# EAGLE design powerholder (EAGLE 8.6.1)
COMPANY: ADAFRUIT INDUSTRIES; DRAWN: KTOWN; REV: A

## Sheet 1 of 2
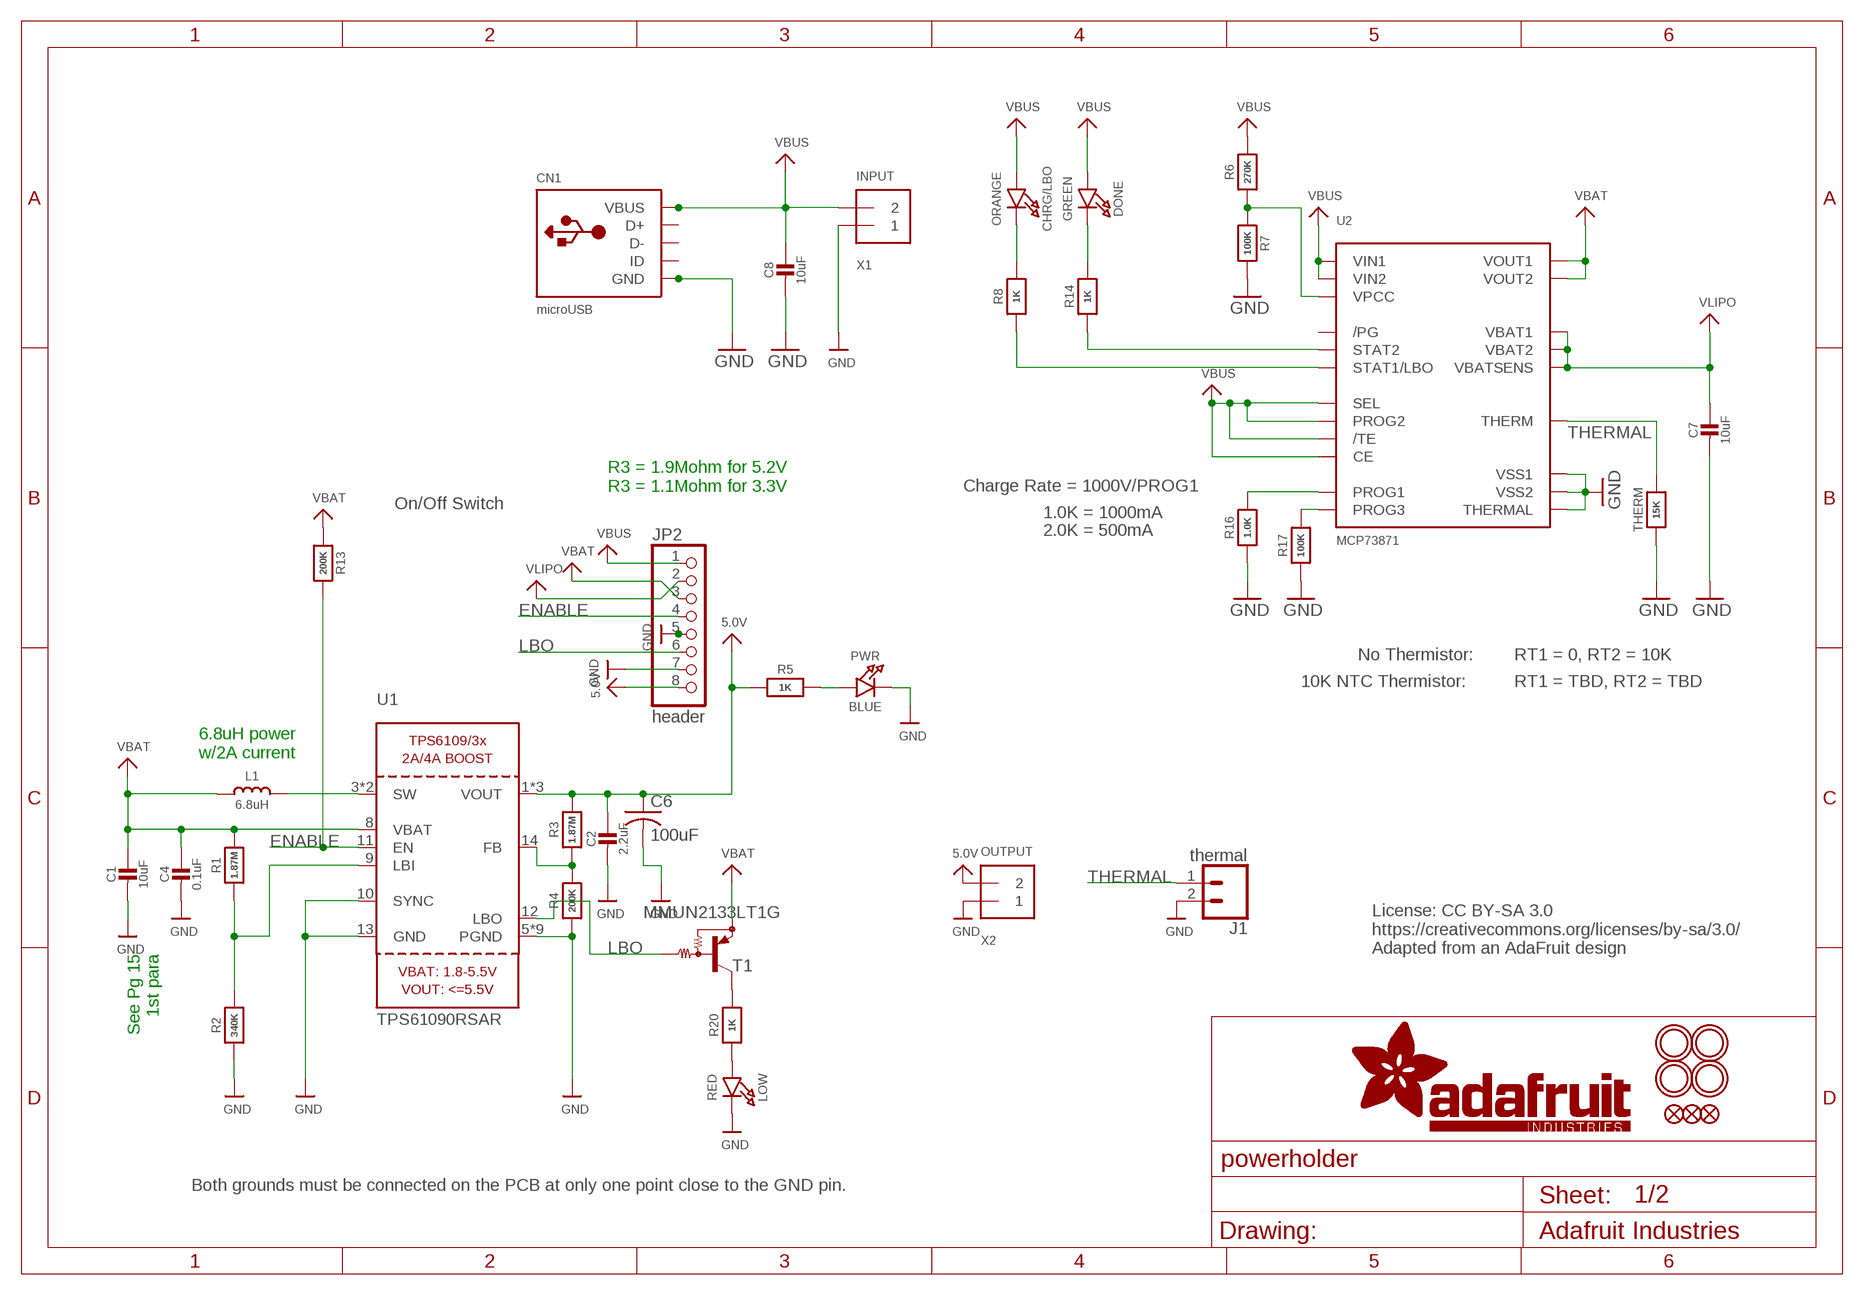
[diagram p0: schematic, sheet 1]

### Parts
C1  10uF  CAP_CERAMIC0805-NOOUTLINE  [0805-NO@1]
C2  2.2uF  CAP_CERAMIC0805-NOOUTLINE  [0805-NO@1]
C4  0.1uF  CAP_CERAMIC0805_10MGAP  [0805_10MGAP]
C6  100uF  C-USC1210  [C1210]
C7  10uF  CAP_CERAMIC0805-NOOUTLINE  [0805-NO@1]
C8  10uF  CAP_CERAMIC0805-NOOUTLINE  [0805-NO@1]
CHRG/LBO  ORANGE  LED0805_NOOUTLINE  [CHIPLED_0805_NOOUTLINE]
CN1  microUSB  USBMICRO_20329  [4UCONN_20329]
DONE  GREEN  LED0805_NOOUTLINE  [CHIPLED_0805_NOOUTLINE]
FID1  FIDUCIAL""  [FIDUCIAL_1MM]
FID2  FIDUCIAL""  [FIDUCIAL_1MM]
FID3  FIDUCIAL""  [FIDUCIAL_1MM]
J1  thermal  CONN_021X02_NO_SILK  [1X02_NO_SILK]
JP2  header  HEADER-1X8ROUND  [1X08_ROUND]
L1  6.8uH  INDUCTORTDK_VLC5045  [INDUCTOR_5X5MM_TDK_VLC5045]
LOW  RED  LED0805_NOOUTLINE  [CHIPLED_0805_NOOUTLINE]
PWR  BLUE  LED0805_NOOUTLINE  [CHIPLED_0805_NOOUTLINE]
R1  1.87M  RESISTOR_0805MP  [_0805MP]
R2  340K  RESISTOR_0805MP  [_0805MP]
R3  1.87M  RESISTOR0805_NOOUTLINE  [0805-NO]
R4  200K  RESISTOR0805_NOOUTLINE  [0805-NO]
R5  1K  RESISTOR0805_NOOUTLINE  [0805-NO]
R6  270K  RESISTOR0805_NOOUTLINE  [0805-NO]
R7  100K  RESISTOR0805_NOOUTLINE  [0805-NO]
R8  1K  RESISTOR0805_NOOUTLINE  [0805-NO]
R13  200K  RESISTOR0805_NOOUTLINE  [0805-NO]
R14  1K  RESISTOR0805_NOOUTLINE  [0805-NO]
R16  1.0K  RESISTOR0805_NOOUTLINE  [0805-NO]
R17  100K  RESISTOR0805_NOOUTLINE  [0805-NO]
R20  1K  RESISTOR0805_NOOUTLINE  [0805-NO]
T1  MMUN2133LT1G  MUN2114T1-PNP_DRIVER-SC59-BEC  [SC59-BEC]
THERM  15K  RESISTOR0805_NOOUTLINE  [0805-NO]
U1  TPS61090RSAR  VREG_TPS6103X  [PVQFN-16]
U2  MCP73871  [QFN20_4MM]
U$10  MOUNTINGHOLE2.5  [MOUNTINGHOLE_2.5_PLATED]
U$11  MOUNTINGHOLE2.5  [MOUNTINGHOLE_2.5_PLATED]
U$50  MOUNTINGHOLE2.5  [MOUNTINGHOLE_2.5_PLATED]
U$51  MOUNTINGHOLE2.5  [MOUNTINGHOLE_2.5_PLATED]
X1  INPUT  TERMBLOCK_1X2  [TERMBLOCK_1X2-3.5MM]
X2  OUTPUT  TERMBLOCK_1X2  [TERMBLOCK_1X2-3.5MM]

### Nets
5.0V: C2.1 C6.1 JP2.8 R3.2 R5.1 U1.1(VOUT) U1.15(VOUT) U1.16(VOUT) X2.2 ; also sheet 2
ENABLE: JP2.4 R13.2 U1.11(EN) ; also sheet 2
GND: C1.2 C2.2 C4.2 C6.2 C7.2 C8.2 CN1.BASE@1(GND) CN1.BASE@2(GND) CN1.GND CN1.SPRT@1(GND) CN1.SPRT@2(GND) CN1.SPRT@3(GND) CN1.SPRT@4(GND) J1.2 JP2.5 JP2.7 LOW.C PWR.C R2.1 R4.1 R7.2 R16.1 R17.1 THERM.1 U1.5(PGND) U1.6(PGND) U1.7(PGND) U1.10(SYNC) U1.13(GND) U1.P$18(PGND) U1.P$19(PGND) U1.P$20(PGND) U1.P$21(PGND) U1.P$22(PGND) U1.THERMAL(PGND) U2.P$10(VSS1) U2.P$11(VSS2) U2.P$21(THERMAL) X1.1 X2.1 ; also sheet 2
LBO: JP2.6 T1.B U1.12(LBO) ; also sheet 2
N$1: L1.P$2 U1.3(SW) U1.4(SW)
N$2: LOW.A R20.1
N$3: R1.1 R2.2 U1.9(LBI)
N$4: PWR.A R5.2
N$5: R3.1 R4.2 U1.14(FB)
N$6: R20.2 T1.C
N$7: R6.1 R7.1 U2.P$2(VPCC)
N$8: DONE.C R14.2
N$9: R14.1 U2.P$7(STAT2)
N$11: R8.1 U2.P$8(STAT1/LBO)
N$12: CHRG/LBO.C R8.2
N$13: R17.2 U2.P$12(PROG3)
N$16: R16.2 U2.P$13(PROG1)
THERMAL: J1.1 THERM.2 U2.P$5(THERM)
VBAT: C1.1 C4.1 JP2.3 L1.P$1 R1.2 R13.1 T1.E U1.8(VBAT) U2.P$1(VOUT1) U2.P$20(VOUT2) ; also sheet 2
VBUS: C8.1 CHRG/LBO.A CN1.VBUS DONE.A JP2.1 R6.2 U2.P$3(SEL) U2.P$4(PROG2) U2.P$9(/TE) U2.P$17(CE) U2.P$18(VIN1) U2.P$19(VIN2) X1.2
VLIPO: C7.1 JP2.2 U2.P$14(VBAT1) U2.P$15(VBAT2) U2.P$16(VBATSENS) ; also sheet 2
Unconnected: CN1.D+ CN1.D- CN1.ID U2.P$6(/PG)

### Notes on the sheet
- R3 = 1.9Mohm for 5.2V
  R3 = 1.1Mohm for 3.3V
- Charge Rate = 1000V/PROG1
- On/Off Switch
- 1.0K = 1000mA
- 2.0K = 500mA
- No Thermistor: | RT1 = 0, RT2 = 10K
- 10K NTC Thermistor: | RT1 = TBD, RT2 = TBD
- 6.8uH power
  w/2A current
- See Pg 15
  1st para
- License: CC BY-SA 3.0
  https://creativecommons.org/licenses/by-sa/3.0/
  Adapted from an AdaFruit design
- Both grounds must be connected on the PCB at only one point close to the GND pin.

## Sheet 2 of 2
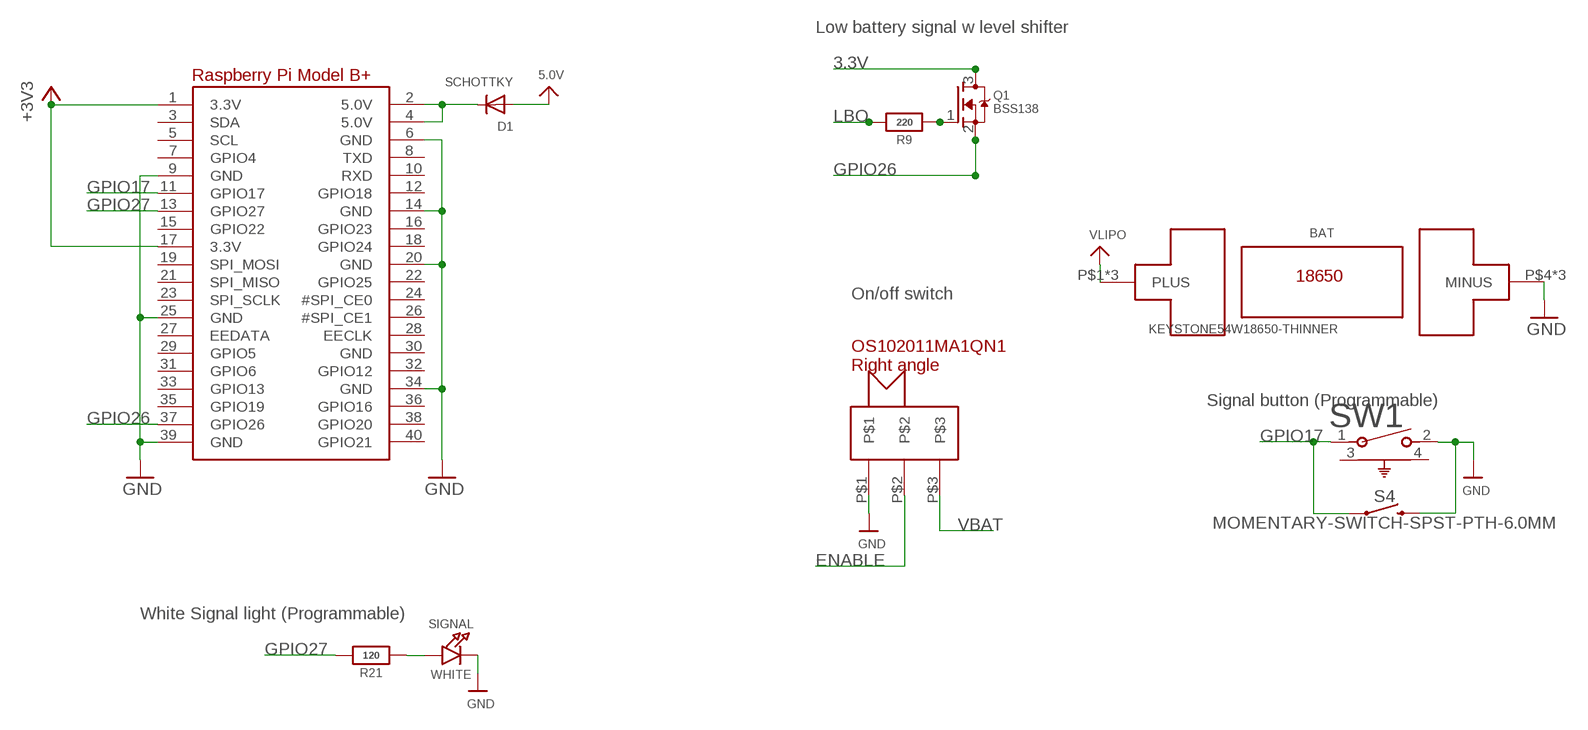
[diagram p1: schematic, sheet 2]

### Parts
BAT  KEYSTONE54W18650-THINNER  [KEYSTONE54W18650-THINNER]
D1  SCHOTTKY  DIODE_SOD-123FL  [SOD-123FL]
Q1  BSS138  MOSFET-NREFLOW  [SOT23-R]
R9  220  RESISTOR0805_NOOUTLINE  [0805-NO]
R21  120  RESISTOR0805_NOOUTLINE  [0805-NO]
RPI1  RASPBERRYPI_BPLUS_BONNETNODIM  [PI_BONNET_NODIM]
S4  MOMENTARY-SWITCH-SPST-PTH-6.0MM  [TACTILE_SWITCH_PTH_6.0MM]
SIGNAL  WHITE  LED0805_NOOUTLINE  [CHIPLED_0805_NOOUTLINE]
SW1  1825027-5  [SW2_1825027-A]
SW2  OS102011MA1QN1  [OS102011MA1QN1]

### Nets
3.3V: Q1.3(D) RPI1.1(3.3V) RPI1.17(3.3V) ; supply symbol labelled +3V3
5.0V: D1.A ; also sheet 1
5.0V@1: D1.C RPI1.2(5.0V) RPI1.4(5.0V)
ENABLE: SW2.P$2 ; also sheet 1
GND: BAT.P$4(MINUS) BAT.P$5(MINUS) BAT.P$6(MINUS) RPI1.6(GND) RPI1.9(GND) RPI1.14(GND) RPI1.20(GND) RPI1.25(GND) RPI1.34(GND) RPI1.39(GND) S4.3 SIGNAL.C SW1.2 SW2.P$1 ; also sheet 1
GPIO17: RPI1.11(GPIO17) S4.1 SW1.1
GPIO26: Q1.2(S) RPI1.37(GPIO26)
GPIO27: R21.2 RPI1.13(GPIO27)
LBO: R9.2 ; also sheet 1
N$14: Q1.1(G) R9.1
N$15: R21.1 SIGNAL.A
VBAT: SW2.P$3 ; also sheet 1
VLIPO: BAT.P$1(PLUS) BAT.P$2(PLUS) BAT.P$3(PLUS) ; also sheet 1
Unconnected: RPI1.3(SDA) RPI1.5(SCL) RPI1.7(GPIO4) RPI1.8(TXD) RPI1.10(RXD) RPI1.12(GPIO18) RPI1.15(GPIO22) RPI1.16(GPIO23) RPI1.18(GPIO24) RPI1.19(SPI_MOSI) RPI1.21(SPI_MISO) RPI1.22(GPIO25) RPI1.23(SPI_SCLK) RPI1.24(#SPI_CE0) RPI1.26(#SPI_CE1) RPI1.27(EEDATA) RPI1.28(EECLK) RPI1.29(GPIO5) RPI1.31(GPIO6) RPI1.32(GPIO12) RPI1.33(GPIO13) RPI1.35(GPIO19) RPI1.36(GPIO16) RPI1.38(GPIO20) RPI1.40(GPIO21) SW1.3 SW1.4

### Notes on the sheet
- Low battery signal w level shifter
- On/off switch
- Signal button (Programmable)
- White Signal light (Programmable)

## Power pins joined to a net without a drawn wire
GND: RPI1.30(GND)

## Library data of the parts
BAT = imp-keystone-battery-clip-54:KEYSTONE54W18650-THINNER
C1 C2 C4 C7 C8 = microbuilder:CAP_CERAMIC: Ceramic Capacitors For new designs, use the packages preceded by an '_' character since they are more reliable: The following footprints should be used on most boards: _0402 - Standard footprint for regular board layouts _0603 - Standard footprint for regular board layouts _0805 - Standard footprint for regular board layouts _1206 - Standard footprint for regular board layouts For extremely tight-pitch boards where space is at a premium, the following 'micro-pitch' footprints can be used (smaller pads, no silkscreen outline, etc.): _0402MP - Micro-pitch footprint for very dense/compact boards _0603MP - Micro-pitch footprint for very dense/compact boards _0805MP - Micro-pitch footprint for very dense/compact boards _1206MP - Micro-pitch footprint for very dense/compact boards
C6 = rcl:C-US: CAPACITOR, American symbol
CHRG/LBO DONE LOW PWR SIGNAL = microbuilder:LED: LED 0603 - 0603 Surface Mount Package 2mA: Green LED - Low Power (3.9mcd, 2ma, 1.7Vf) - Digikey: 475-2709-2-ND Orange LED - Low Power (9.8mcd, 2ma, 1.8Vf) - Digikey: 475-1194-2-ND Red LED - Low Power (5mcd, 2ma, 1.8Vf) - Digikey: 475-1195-2-ND Yellow LED - Low Power (7mcd, 2ma, 1.8Vf) - Digikey: 475-1196-2-ND 5mA: Blue LED - Low Power (17mcd, 5ma, 2.9Vf) - Digikey: LNJ937W8CRACT-ND 0805 - 0805 Surface Mount Package 2mA: Red LED (8.8mcd, 2mA, 1.8Vf, Clear) - Low Power [Digikey: 475-2510-1-ND] Green LED (5mcd, 2mA, 1.8Vf, Clear) - Low Power [Digikey: 475-2730-1-ND] Yellow LED (11.3mcd, 2mA, 1.8Vf, Clear) - Low Power [Digikey: 475-2555-1-ND] 20mA: Red LED (104mcd, 20mA, Diffused) - LS R976 [Digikey: 475-1278-6-ND] Red LED (12mcd, 20mA, 2.0Vf, Clear) - APT2012EC [Digikey: 754-1128-1-ND] Green LED (15mcd, 20mA, 2.2Vf, Clear) - APT2012GC [Digikey: 754-1131-1-ND] Orange LED (160mcd, 20mA, 2.1Vf, Clear) - APT2012SECK [Digikey: 754-1130-1-ND] 1206 - 1206 Surface Mount Package Green LED (26mcd, 20mA, Diffused) - LG N971 [Digikey: 475-1407-6-ND] Red LED (15mcd, 20mA, Diffused) - LH N974 [Digikey: 475-1416-6-ND] Cree - Cree High-Power Surface Mount LEDs XPEBWT-L1-0000-00D50 - White 111lm 350mA 2.9Vf 6200K 110° XTEAWT-00-0000-00000LEE3 - White 114lm 350mA 2.85Vf 5000K 115° Everlight - Everlight 45-21 Series Surface Mount LEDs 45-21/QK2C-B2832AC2CB2/2T - Warm White 2000mcd 20mA 3.25Vf 3050K 120° 45-21/LK2C-B38452C4CB2/2T - Nuetral White 2000mcd 20mA 3.25Vf 4150K 120° 45-21/LK2C-B50634C6CB2/2T - Cold White 2200mcd 20mA 3.25Vf 5650K 120° PLCC2 Reverse Mount LS T77K-J1L2-1-0-2-R18-Z - Red 11.25mcd 2mA 1.8Vf 630nm 120° LO T77K-L1M2-24-Z - Orange 19.6mcd 2mA 1.8Vf 606nm 120° LY T77K-K2M1-26-Z - Yellow 15.7mcd 2mA 1.8Vf 587nm 120°
CN1 = microusb-amphenol-10118194-0001LF:USB: USB Connectors USBMINIB - Surface Mount Female Mini-B USB Connector 4UConnector: 06564
D1 = adafruit:DIODE: Diode SMADIODE - SMA Surface Mount Package 20V 1A Schottky Diode Digikey: 641-1014-6-ND DO-1N4148 - Through Hole Small Current Diode SOD-123 20V 1 A (.5mV Vf) Schottky Diode - Digikey: MBRX120TPMSCT-ND SOD-323 10V 570mA (.38mV Vf, 3ns) Schottky Diode - Digikey: ZLLS410CT-ND SOD-523 30V 30mA Schottky Diode (RB751S-40TE61) - Digikey: RB751S-40TE61CT-ND SOT23-R/W - SOT23 Package (R = Solder Paste/Reflow Ovens, W = Hand-Soldering) BAT54Film 40V 300mA - Digikey: 497-7162-1-ND
FID1-FID3 = microbuilder:FIDUCIAL: Fiducial Alignment Points Various fiducial points for machine vision alignment.; BOM: EXCLUDE
J1 = SparkFun-Connectors:CONN_02: Multi connection point. Often used as Generic Header-pin footprint for 0.1 inch spaced/style header connections On any of the 0.1 inch spaced packages, you can populate with these: Break Away Headers - Straight <https://www.sparkfun.com/products/116> (PRT-00116) Break Away Male Headers - Right Angle <https://www.sparkfun.com/products/553> (PRT-00553) Female Headers <https://www.sparkfun.com/products/115> (PRT-00115) Break Away Headers - Machine Pin <https://www.sparkfun.com/products/117> (PRT-00117) Break Away Female Headers - Swiss Machine Pin <https://www.sparkfun.com/products/743> (PRT-00743) For SCREWTERMINALS and SPRING TERMINALS visit here: Screw Terimnals on SparkFun.com <https://www.sparkfun.com/search/results?term=Screw+Terminals> (5mm/3.5mm/2.54mm spacing) This device is also useful as a general connection point to wire up your design to another part of your project. Our various solder wires solder well into these plated through hole pads. Hook-Up Wire - Assortment (Stranded, 22 AWG) <https://www.sparkfun.com/products/11375> (PRT-11375) Hook-Up Wire - Assortment (Solid Core, 22 AWG) <https://www.sparkfun.com/products/11367> (PRT-11367) View the entire wire category on our website here <https://www.sparkfun.com/categories/141> Special notes: Molex polarized connector foot print use with: PRT-08233 with associated crimp pins and housings. 2.54_SCREWTERM for use with PRT-10571. 3.5mm Screw Terminal footprints for PRT-08084 5mm Screw Terminal footprints for use with PRT-08432
JP2 = microbuilder:HEADER-1X8: PIN HEADER
L1 = microbuilder:INDUCTOR: Inductors 0603: 10nH Ceramic Inductor - microwire antenna/RF (Digikey: 712-1434-2-ND) 0805: 560nH Ceramic Inductor - RF (Digikey: 553-1047-1-ND) 270nH Ceramic Inductor - Q = 40@250MHz, +-5%, 1 Ohm DC Resistance (Digikey: 535-10506-2-ND) 1007 (2518 Metric) SMT: 10µH 10% 250mOhm 820mA 1007 Inductor (Digikey: 587-2189-1-ND) 22µH 10% 500mOhm 580mA 1007 Inductor (Digikey: 587-2190-1-ND) 47µH 10% 950mOhm 420mA 1007 Inductor (Digikey: 587-2191-1-ND) 47µH 5% 100mOhm 1A 1008 Inductor (Digikey: 732-1816-1-ND) 5.0x5.0mm (Taiyo Yuden NR5040 Series) 6.8µH 20% 2.3A 64mOhm Inductor (Digikey: 587-2374-2-ND) 5.0x5.0mm (TDK VLC5045 Series) 4.7µH 20% 3.3A 34mOhm Inductor (Digikey: 445-6526-1-ND) 6.8µH 20% 2.7A 46mOhm Inductor (Digikey: 445-6527-1-ND) 6.0x6.0mm (TDK VLC6045 Series) 4.7µH 20% 3.8A 27mOhm Inductor (Digikey: 445-6538-2-ND) 6.8µH 20% 3A 41mOhm Inductor (Digikey: 445-6540-1-ND) 6.2µH 30% 2.2A 45mOhm Inductor (Digikey: SRR5028-6R2YCT-ND) - Not TDK VLC6045 but footprint should match 6.0x6.0mm (TDK SLF6045 Series) 6.8uH 30% 2A 33mOhm Inductor (Digikey: 445-4572-1-ND, Mouser: 810-SLF645T6R8N2R0PF) 6.0x6.0mm (Sumida CDRH5D28 Series) 6.2uH 30% 1.8A 45mOhm Inductor (Digikey: 308-1542-1-ND) Taiyo Yuden NR3015T2R2M - 2.2uH 20% 1.5A (Digikey: 587-1648-2-ND, Mouser: 963-NR3015T2R2M) - Used with TI TPS62172 CoilCraft RFID Transponder Coil - MA5532-AE (For use with AS3935 Lightning Sensor) Vishay IHLP 1.0uH Molded Inductor - 24mOhm DCR, 5A, +/-20%, -55°C-125°C (Digikey: 541-1319-1-ND)
Q1 = microbuilder:MOSFET-N: N-Channel Mosfet LEGEND VDS: Voltage Drain-Source ID: Drain Current RDS(ON): Drain-Source On-State Resistance VGS(TH): Gate-Source Threshold Voltage CISS: Drain-Source Input Capacitance SOT-23 Name VDS ID RDS(ON) VGS(TH) CISS Order Number 2N7002E 60V 260mA 2.5 Ohm 2.5V @ 250uA 26.7pF @ 25V 2N7002ET1GOSTR-ND BSH103 30V 850mA 400 mOhm 400mV @ 1mA 83pF @ 24V BSH103,235-ND BSS138 60V 320mA 1.6 Ohm 1.5V @ 250uA 50pF @ 10V Mouser: 771-BSS138PW115 DMN2075U-7 20V 4.2A 38 mOhm 1V @ 250 uA 594.3pF @ 10V DMN2075U-7DICT-ND * BSS138 good choice for I2C level-shifting
R1-R9 R13 R14 R16 R17 R20 R21 THERM = microbuilder:RESISTOR: Resistors For new designs, use the packages preceded by an '_' character since they are more reliable: The following footprints should be used on most boards: _0402 - Standard footprint for regular board layouts _0603 - Standard footprint for regular board layouts _0805 - Standard footprint for regular board layouts _1206 - Standard footprint for regular board layouts For extremely tight-pitch boards where space is at a premium, the following 'micro-pitch' footprints can be used (smaller pads, no silkscreen outline, etc.): _0402MP - Micro-pitch footprint for very dense/compact boards _0603MP - Micro-pitch footprint for very dense/compact boards _0805MP - Micro-pitch footprint for very dense/compact boards _1206MP - Micro-pitch footprint for very dense/compact boards
RPI1 = microbuilder:RASPBERRYPI_BPLUS
S4 = SparkFun-Switches:MOMENTARY-SWITCH-SPST: Momentary Switch (Pushbutton) - SPST Normally-open (NO) SPST momentary switches (buttons, pushbuttons). Variants PTH-12MM - 12mm square, through-hole Momentary Pushbutton Switch - 12mm Square <https://www.sparkfun.com/products/9190> (COM-09190) PTH-6.0MM, PTH-6.0MM-KIT - 6.0mm square, through-hole Mini Pushbutton Switch <https://www.sparkfun.com/products/97> (COM-00097) KIT package intended for soldering kit's - only one side of pads' copper is exposed. PTH-RIGHT-ANGLE-KIT - Right-angle, through-hole Right Angle Tactile Button <https://www.sparkfun.com/products/10791> - Used on SparkFun BigTime Watch Kit <https://www.sparkfun.com/products/11734> SMD-12MM - 12mm square, surface-mount Tactile Button - SMD (12mm) <https://www.sparkfun.com/products/12993> (COM-12993) Used on SparkFun PicoBoard <https://www.sparkfun.com/products/11888> SMD-4.5MM - 4.5mm Square Trackball Switch Used on SparkFun Blackberry Trackballer Breakout <https://www.sparkfun.com/products/13169> SMD-4.6MMX2.8MM - 4.60mm x 2.80mm, surface mount Used on SparkFun SAMD21 Mini Breakout <https://www.sparkfun.com/products/13664> SMD-5.2MM, SMD-5.2-REDUNDANT - 5.2mm square, surface-mount Mini Pushbutton Switch - SMD <https://www.sparkfun.com/products/8720> (COM-08720) Used on Arduino Pro Mini <https://www.sparkfun.com/products/11114> REDUNDANT package connects both switch circuits together SMD-6.0X3.5MM - 6.0 x 3.5mm, surface mount Momentary Reset Switch SMD <https://www.sparkfun.com/products/8229> (COM-08229) SMD-6.2MM-TALL - 6.2mm square, surface mount Tactile Button - SMD (6mm) <https://www.sparkfun.com/products/12992> Used on SparkFun Digital Sandbox <https://www.sparkfun.com/products/12651> SMD-RIGHT-ANGLE - Right-angle, surface mount Used on SparkFun Block for Intel® Edison - Arduino <https://www.sparkfun.com/products/13036>; PROD_ID: SWCH-08441; SF_SKU: COM-00097
SW1 = right angle tactile switch 1825027-5 te connect:1825027-5: Digi-Key part <https://www.digikey.com/product-detail/en/te-connectivity-alcoswitch-switches/1825027-5/450-1662-ND/529484>; MANUFACTURER_PART_NUMBER: 18250275; VENDOR: TE Connectivity
SW2 = rightangleslideswitchspdt:OS102011MA1QN1: OS102011MA1QN1 right angle SPDT slide switch from C&K Vendor Specs <https://www.ckswitches.com/media/1428/os.pdf> Digikey part <https://www.digikey.com/product-detail/en/c-k/OS102011MA1QN1/CKN9559-ND/1981430>
T1 = transistor:*-PNP_DRIVER-: PNP Bias Resistor Transistor
U1 = microbuilder:VREG_TPS6103X: TPS6103x 4A Boost - 1.8-5.5V Input, Adjustable Output to 5.5V
U2 = microbuilder:MCP73871: MCP73871 Lithium Polymer Battery Charger Digikey: MCP73871-2CCI/ML-ND
U$10 U$11 U$50 U$51 = microbuilder:MOUNTINGHOLE: Mounting Hole For #2 screws (0.086"/2.18mm width, 0.094"/2.4mm hole) use 2.5mm; BOM: EXCLUDE
X1 X2 = microbuilder:TERMBLOCK_1X2: 3.5mm Terminal block http://www.ladyada.net/library/pcb/eaglelibrary.html

## Board
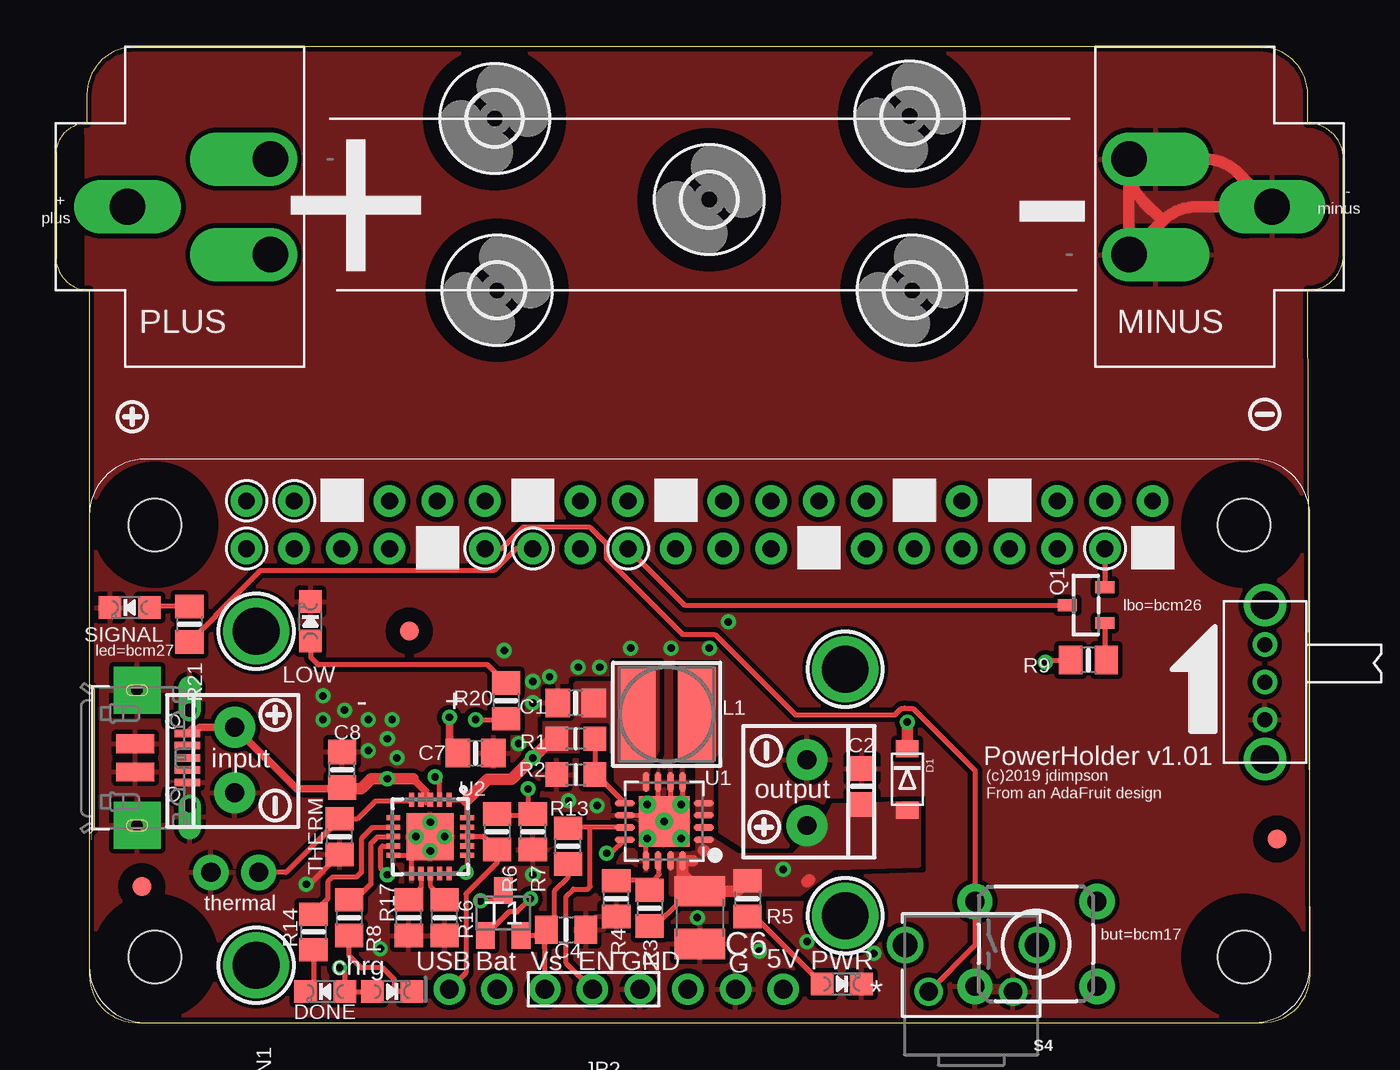
[diagram p2: board, top side]
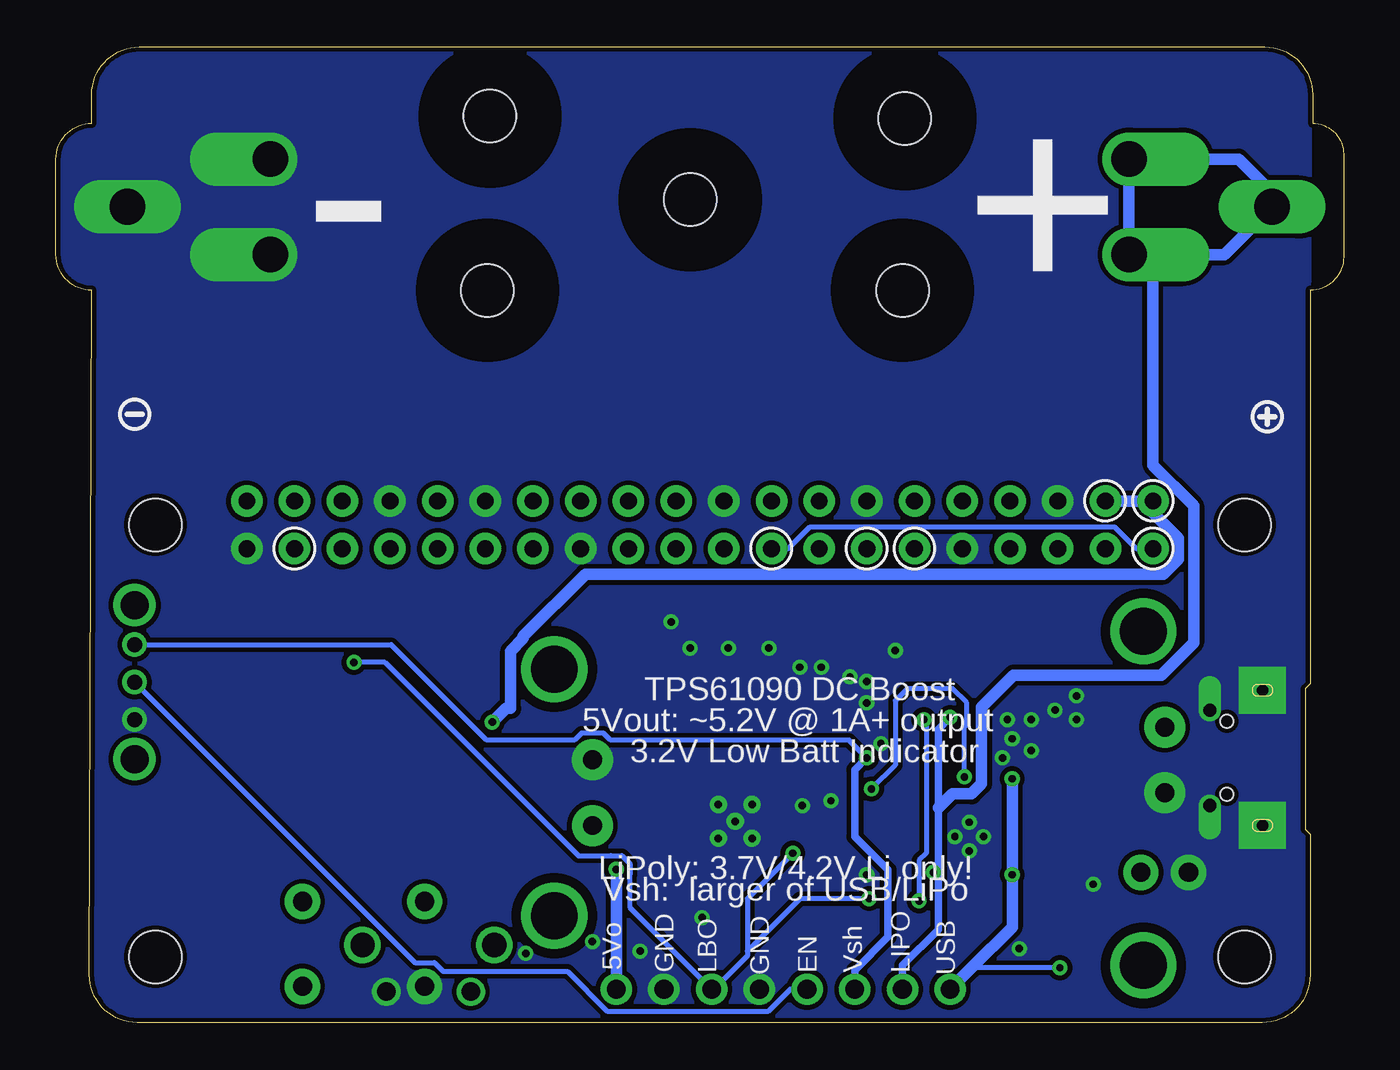
[diagram p3: board, bottom side, seen from below]

Size 68.58 x 51.94 mm. Coordinates in mm from the lower left corner, seen from the top.
Outline: 1.78,10.03 1.78,2.54 arc90 4.32,0 64.25,0 arc90 66.79,2.55 66.68,38.99 arc90 68.58,40.89 68.58,45.97 arc90 66.68,47.88 66.68,49.4 arc90 64.14,51.94 4.19,51.94 arc90 1.65,49.4 1.65,47.88 arc90 0,46.23 0,40.77 arc90 1.78,38.99 1.78,18.03 2.03,17.78 2.03,10.29 1.78,10.03
Copper layers (1*16): Top 0.035mm / dielectric 1.5mm / Bottom 0.035mm
Design rules "adafruit *": minimum track width 8mil, minimum drill 15.5mil, track to track 8mil, track to pad 8mil, pad to pad 8mil, via to via 8mil, smd to smd 8mil, copper to edge 10mil, drill to drill 8mil, minimum pad ring 10mil, minimum via ring 8mil, stop-mask expansion 2mil, vias tented up to drill 20mil, thermal gap 10mil

### Footprints (pad centres in the part's own frame; a part is rotated, then mirrored left to right if it is on the bottom)
KEYSTONE54W18650-THINNER = drill 1.905 offset: P$1 -20.955,-2.159; P$2 -20.955,2.921; P$4 24.765,2.921; P$5 24.765,-2.159 | drill 1.905 long: P$3 -28.575,0.381; P$6 32.385,0.381
0805-NO@1 = smd 1.3 x 1.5: 1 -0.95,0; 2 0.95,0
0805_10MGAP = smd 1.2 x 1.5: 1 -1.05,0; 2 1.05,0
C1210 = smd 1.6 x 2.7: 1 -1.4,0; 2 1.4,0
CHIPLED_0805_NOOUTLINE = smd 1.2 x 1.2: A 0,-1.05; C 0,1.05
4UCONN_20329 = smd 1 x 2: BASE@1 -0.75,-2; BASE@2 0.75,-2 | smd 0.4 x 1.35: D+ 0,0.775; D- -0.65,0.775; GND 1.3,0.775; ID 0.65,0.775; VBUS -1.3,0.775 | drill 0.7 offset: SPRT@1 -2.538,0.9; SPRT@2 2.538,0.9 | drill 0.6 pad 2.5 square: SPRT@3 -3.6,-1.9; SPRT@4 3.6,-1.9 | hole 0.7: -1.95,0; 1.95,0
SOD-123FL = smd 0.91 x 1.22: A 1.637,0; C -1.637,0
FIDUCIAL_1MM = smd 1 x 1: 1 0,0
1X02_NO_SILK = drill 1.016 pad 1.88: 1 0,0; 2 2.54,0
1X08_ROUND = drill 1 pad 1.676: 1 -8.89,0; 2 -6.35,0; 3 -3.81,0; 4 -1.27,0; 5 1.27,0; 6 3.81,0; 7 6.35,0; 8 8.89,0
INDUCTOR_5X5MM_TDK_VLC5045 = smd 2 x 5: P$1 -1.6,0; P$2 1.6,0
SOT23-R = smd 0.635 x 1.016: 1 -0.95,-1; 2 0.95,-1; 3 0,1
_0805MP = smd 1.2 x 1.3: 1 -1.016,0; 2 1.016,0
0805-NO = smd 1.24 x 1.5: 1 -0.95,0; 2 0.95,0
PI_BONNET_NODIM = drill 0.9 pad 1.676: 1 8.37,25.23; 2 8.37,27.77; 3 10.91,25.23; 4 10.91,27.77; 5 13.45,25.23; 6 13.45,27.77; 7 15.99,25.23; 8 15.99,27.77; 9 18.53,25.23; 10 18.53,27.77; 11 21.07,25.23; 12 21.07,27.77; 13 23.61,25.23; 14 23.61,27.77; 15 26.15,25.23; 16 26.15,27.77; 17 28.69,25.23; 18 28.69,27.77; 19 31.23,25.23; 20 31.23,27.77; 21 33.77,25.23; 22 33.77,27.77; 23 36.31,25.23; 24 36.31,27.77; 25 38.85,25.23; 26 38.85,27.77; 27 41.39,25.23; 28 41.39,27.77; 29 43.93,25.23; 30 43.93,27.77; 31 46.47,25.23; 32 46.47,27.77; 33 49.01,25.23; 34 49.01,27.77; 35 51.55,25.23; 36 51.55,27.77; 37 54.09,25.23; 38 54.09,27.77; 39 56.63,25.23; 40 56.63,27.77 | hole 2.8: 3.5,3.5; 3.5,26.5; 61.5,26.5; 61.5,3.5
TACTILE_SWITCH_PTH_6.0MM = drill 1.016 pad 1.88: 1 -3.251,2.261; 2 3.251,2.261; 3 -3.251,-2.261; 4 3.251,-2.261
SW2_1825027-A = drill 0.991 pad 1.499: 1 0,0; 2 4.496,0 | drill 1.295 pad 1.803: 3 -1.245,2.489; 4 5.766,2.489
OS102011MA1QN1 = drill 0.8: P$1 0,0; P$2 2,0; P$3 4,0 | drill 1.5: P$4 -2.1,0; P$5 6.1,0
SC59-BEC = smd 1 x 1.4: B -0.95,-1.2; C 0,1.2; E 0.95,-1.2
PVQFN-16 = smd 1.05 x 0.35: 1 -2.1,0.975; 2 -2.1,0.325; 3 -2.1,-0.325; 4 -2.1,-0.975; 9 2.1,-0.975; 10 2.1,-0.325; 11 2.1,0.325; 12 2.1,0.975 | smd 0.35 x 1.05: 5 -0.975,-2.1; 6 -0.325,-2.1; 7 0.325,-2.1; 8 0.975,-2.1; 13 0.975,2.1; 14 0.325,2.1; 15 -0.325,2.1; 16 -0.975,2.1 | drill 0.4: P$18 0,0; P$19 -0.9,0.9; P$20 0.9,0.9; P$21 0.9,-0.9; P$22 -0.9,-0.9 | smd 2.7 x 2.7: THERMAL 0,0
QFN20_4MM = smd 0.73 x 0.28: P$1 -1.965,1; P$2 -1.965,0.5; P$3 -1.965,0; P$4 -1.965,-0.5; P$5 -1.965,-1; P$11 1.965,-1; P$12 1.965,-0.5; P$13 1.965,0; P$14 1.965,0.5; P$15 1.965,1 | smd 0.28 x 0.73: P$6 -1,-1.965; P$7 -0.5,-1.965; P$8 0,-1.965; P$9 0.5,-1.965; P$10 1,-1.965; P$16 1,1.965; P$17 0.5,1.965; P$18 0,1.965; P$19 -0.5,1.965; P$20 -1,1.965 | smd 2.5 x 2.5: P$21 0,0
2,8 = hole 2.8: 0,0
MOUNTINGHOLE_2.5_PLATED = drill 2.5 pad 3.2: P$1 0,0
TERMBLOCK_1X2-3.5MM = drill 1 pad 2.184: 1 1.8,0; 2 -1.7,0

### Placement (x,y rotation side)
BAT  32.38,43.05 0 top
C1  27.69,17.02 180 top
C2  42.93,12.57 90 top
C4  27.18,4.95 0 top
C6  34.29,5.59 270 top
C7  22.35,14.35 0 top
C8  15.24,13.46 90 top
CHRG/LBO  17.91,1.65 270 top
CN1  6.22,14.1 270 top
D1  45.34,12.95 270 top
DONE  14.35,1.65 90 top
FID1  65.02,9.78 0 top
FID2  18.82,20.85 90 top
FID3  4.57,7.24 0 top
J1  10.79,8 180 top
JP2  29.84,1.78 0 top
L1  32.53,16.41 0 top
LOW  13.56,21.37 0 top
PWR  41.85,2.06 270 top
Q1  54.86,22.23 90 top
R1  27.69,15.11 180 top
R2  27.69,13.21 0 top
R3  31.62,6.1 270 top
R4  29.84,6.6 90 top
R5  36.83,6.6 270 top
R6  23.49,10.16 270 top
R7  25.4,10.16 270 top
R8  15.62,5.59 270 top
R9  54.99,19.3 180 top
R13  27.27,9.4 90 top
R14  13.72,4.83 270 top
R16  20.7,5.59 90 top
R17  18.8,5.59 90 top
R20  23.97,17.13 270 top
R21  7.11,21.21 270 top
RPI1  1.78,0 0 top
S4  52.2,4.19 0 top
SIGNAL  3.94,22.1 90 top
SW1  46.48,1.65 0 top
SW2  64.39,16.13 90 top
T1  23.83,5.84 0 top
THERM  15.11,9.91 90 top
U1  32.4,10.71 180 top
U2  19.94,9.91 270 top
U$5  [2,8]  34.8,43.81 0 top
U$10  10.67,20.83 0 top
U$11  10.67,3.05 0 top
U$12  [SYMBOL_MINUS]  64.39,32.38 180 top
U$15  [2,8]  23.37,48.13 0 top
U$16  [2,8]  23.49,38.99 0 top
U$17  [2,8]  45.59,38.99 0 top
U$18  [2,8]  45.47,48.26 0 top
U$21  [SYMBOL_PLUS]  4.06,32.26 90 top
U$22  [SYMBOL_PLUS]  11.68,16.38 90 top
U$28  [SYMBOL_MINUS]  11.68,11.56 270 top
U$45  [SYMBOL_PLUS]  37.72,10.41 90 top
U$50  42.04,18.82 0 top
U$51  42.04,5.69 0 top
U$52  [SYMBOL_PLUS]  4.06,32.26 90 bottom
U$53  [SYMBOL_MINUS]  64.39,32.38 180 bottom
U$54  [SYMBOL_MINUS]  37.85,14.48 270 top
X1  9.53,14.03 270 top
X2  40,12.19 90 top

### Tracks (layer width: path | path; a pad name or v marks a point on that pad's centre or on a via)
3.3V
  Top 0.254: RPI1.17 33.47,22.23 Q1.3
  Bottom 0.254: RPI1.17 29.58,25.23 28.41,26.4 12.2,26.4 11.04,25.23 RPI1.1
5.0V  (via drill 0.39)
  Top 0.254: R3.2 31.94,5.15 33.15,6.35 33.65,6.35 C6.1
  Top 0.61: 40,7.49 40.13,7.62 | 34.5,9.19 34.54,9.14 | 33.92,8.61 U1.16 33.37,7.9 C6.1 36.26,6.99 R5.1
  Bottom 0.61: JP2.8 v38.73,8.16
  pour Top (isolate 0.254, no thermals): 32.77,9.02 32.77,6.86 39.62,6.86 41.4,8.26 45.97,8.38 45.97,11.68 41.4,11.56 40.51,9.78 40.13,9.78 39.24,8.89 36.32,8.89 34.92,9.78 34.16,9.78 34.16,9.02
5.0V@1  (via drill 0.39)
  Top 0.61: D1.C v45.34,16
  Bottom 0.61: RPI1.4 RPI1.2 10.15,27.13 8.8,25.79 8.8,24.67 9.59,23.88 40.38,23.88 43.69,20.57 43.69,20.45 44.36,19.78 44.36,16.73 44.61,16.73 v45.34,16
ENABLE
  Top 0.254: U1.11 28.45,10.39 | 28.45,10.39 27.31,10.39 R13.2 | JP2.4 27.18,3.17 27.18,6.73 27.56,7.11 28.32,7.11 28.45,7.24 28.45,10.39
  Bottom 0.254: SW2.P$2 49.46,3.2 48.42,3.2 47.95,2.73 41.34,2.73 39.22,0.61 30.63,0.61 29.46,1.78 JP2.4
GND  (via drill 0.39)
  Top 0.254: U1.13 31.42,9.58 31.62,9.78 31.53,9.78 U1.P$20 | U1.10 31.74,11.04 31.75,11.05 31.5,11.3 U1.P$21 31.57,11.68 32,11.68 32.07,11.75 U1.7 | U1.6 32.72,11.47 32.89,11.3 | U1.5 33.37,11.69 U1.P$22 | U2.P$11 18.94,9.67 v19.18,9.91 | U2.P$10 19.7,8.91 v19.94,9.14 | THERM.1 13.52,7.37 v13.34,7.37
  Top 0.61: BAT.P$4 BAT.P$5 58.95,42.69 | BAT.P$4 61.18,45.97 arc-45 62.97,45.23 BAT.P$6 60.74,43.43 arc45 58.95,42.69 | BAT.P$4 57.15,45.54 arc45 57.89,43.74 58.95,42.69
  other vias: 35.81,21.34 34.16,5.59 37.46,3.81 40,4.32 43.56,3.68 27.3,11.81 25.4,7.87 19.94,10.67 17.27,3.94 28.83,11.56 20.7,9.91 24.64,14.86 27.81,18.92 28.96,18.92 23.88,19.81 25.4,17.02 26.29,18.41 25.4,18.16 16.64,16.13 16.64,14.48 14.22,16.13 14.22,17.4 15.37,16.64 34.8,19.94 32.77,19.94 30.61,19.94 18.16,14.1 17.65,15.11 17.91,16.13
  pour Top (isolate 0.254, rank 2): 1.78,0.38 1.65,52.45 66.68,52.32 66.68,47.88 70.23,47.88 70.23,35.43 66.68,35.43 66.8,0.25
  pour Bottom (isolate 0.254, no thermals): 1.78,52.45 66.55,52.45 66.68,47.88 70.23,47.88 70.23,35.43 66.68,35.43 66.8,0.25 2.03,0.25
GPIO17
  Top 0.254: RPI1.11 23.74,25.23 24.9,26.4 28.41,26.4 29.3,25.51 29.3,24.75 33.38,20.67 34.92,20.67 35.1,20.67 39.39,16.38 44.69,16.38 45.04,16.73 45.18,16.73 45.21,16.76 45.24,16.73 45.64,16.73 48.95,13.43 S4.1 48.95,6.35 48.95,4.12 SW1.1
GPIO26
  Top 0.254: RPI1.37 Q1.2
GPIO27
  Top 0.254: R21.2 8.53,21.67 8.53,21.72 10.87,24.06 23.33,24.06 24.5,25.23 RPI1.13
LBO  (via drill 0.39)
  Top 0.254: U1.12 29.58,9.02 v29.34,9.02 | v25.27,6.6 24.57,5.9 24.13,5.9 T1.B | v52.7,19.18 52.83,19.3 R9.2
  Bottom 0.254: v29.34,9.02 31.75,6.6 31.75,3.81 | 31.75,3.81 31.75,3.56 33.53,1.78 JP2.6 38.03,6.15 38.03,7.84 38,7.86 38,8.47 38.43,8.89 39.04,8.89 39.06,8.87 40.75,8.87 51.05,19.18 v52.7,19.18 | v25.27,6.6 28.96,6.6 31.75,3.81
N$1
  pour Top (isolate 0.254, no thermals): 34.16,11.05 34.92,11.05 34.92,13.97 35.18,14.35 35.18,18.92 33.27,18.92 33.27,13.97 34.16,13.97
N$2
  Top 0.254: R20.1 23,19.05 13.97,19.05 13.59,19.43 13.59,20.29 LOW.A
N$3
  Top 0.254: R1.1 R2.2 29.07,12.84 29.14,12.84 U1.9
N$4
  Top 0.254: R5.2 37.21,5.65 PWR.A
N$5
  Top 0.254: 31.88,7.62 32.13,7.87 32.13,8.56 U1.14 | R4.2 29.84,7.62 31.88,7.62 | R3.1 31.62,7.37 31.88,7.62
N$6  (via drill 0.39)
  Top 0.254: v22.61,6.48 23.26,6.48 T1.C | v22.35,16.13 23.92,16.13 R20.2
  Bottom 0.254: v22.35,16.13 22.22,16 22.22,9.02 22.61,8.64 v22.61,6.48
N$7  (via drill 0.39)
  Top 0.254: R6.1 23.56,11.11 23.62,11.05 25.34,11.05 R7.1 | R7.1 25.46,11.05 | U2.P$2 20.44,12.84 v20.19,13.08 | v25.15,12.45 25.15,11.36 R7.1
  Bottom 0.254: v20.19,13.08 20.19,15.75 20.07,15.88 20.07,17.02 20.83,17.78 23.24,17.78 23.88,17.14 23.88,13.72 v25.15,12.45
N$8
  Top 0.254: R14.2 13.72,2.07 DONE.C
N$9
  Top 0.254: R14.1 13.72,5.84 14.48,6.6 14.48,7.49 14.73,7.75 16,7.75 16.26,8 16.26,9.78 16.87,10.39 17.96,10.39 U2.P$7
N$11
  Top 0.254: R8.1 15.81,6.73 16.13,6.73 16.76,7.37 16.76,9.53 17.13,9.89 17.96,9.89 U2.P$8
N$12
  Top 0.254: CHRG/LBO.C 18.29,1.65 18.03,1.91 18.03,2.29 17.4,2.92 16.26,2.92 15.62,3.56 R8.2
N$13
  Top 0.254: U2.P$12 19.44,7.18 R17.2
N$14
  Top 0.254: Q1.1 55.86,19.38 R9.1
N$15
  Top 0.254: R21.1 5.05,22.16 SIGNAL.A
N$16
  Top 0.254: U2.P$13 19.94,7.3 R16.2
THERMAL
  Top 0.254: THERM.2 16.06,10.86 17.02,11.81 18.94,11.81 U2.P$5 | THERM.2 15.11,10.79 14.03,9.71 | THERM.2 12.26,8 J1.1
VBAT  (via drill 0.39)
  Top 0.254: R13.1 27.27,7.71 26.54,6.99 26.54,5.37 C4.1 25.82,4.64 T1.E | 26.04,4 JP2.3 | U2.P$1 21.78,11.87 21.84,11.81 21.96,11.7 21.9,11.65 U2.P$20
  Top 0.305: 26.04,4 26.04,4.86 C4.1
  Top 0.61: 21.84,11.81 22.99,12.95 24.26,12.95 v25.4,14.1 26.29,14.99 26.67,14.99 R1.2
  Bottom 0.254: SW2.P$3 50.72,20.13 45.63,15.04 40.97,15.04 40.59,15.41 39.42,15.41 39.04,15.04 26.34,15.04 v25.4,14.1
  Bottom 0.406: v25.4,14.1 26.04,13.46 26.04,9.91 24.26,8.13 24.26,4.57 26.04,2.79 JP2.3
  pour Top (isolate 0.254, no thermals): 31.5,12.45 29.84,12.45 29.84,19.05 32,19.05 32,14.48 31.5,13.46
  pour Top (no thermals): 27.69,18.03 27.69,16 26.04,16 26.04,14.48 29.72,14.48 29.84,18.03
VBUS  (via drill 0.39)
  Top 0.254: v17.65,7.87 17.27,8.26 17.27,9.27 17.39,9.39 17.96,9.39 U2.P$9 | CHRG/LBO.A DONE.A 15.4,2.63 v15.11,2.92 | JP2.1 21.84,2.67 21.84,6.86 23.49,8.51 R6.2 22.81,9.89 21.92,9.89 U2.P$18 | U2.P$4 U2.P$3 19.77,11.87 19.76,11.86 | U2.P$19 U2.P$18 | U2.P$18 U2.P$17
  Top 0.406: 19.02,12.98 19.68,12.32 19.68,11.93 | 23.31,9.39 R6.2 | CN1.VBUS 7.23,15.62 7.54,15.62 7.65,15.73 X1.2 12.81,12.45 15.31,12.45
  Top 0.61: 19.02,12.98 v17.65,12.98 16.79,12.98 16.26,12.45 15.31,12.45 C8.1 | 19.76,11.86 19.68,11.93
  Bottom 0.254: v15.11,2.92 19.81,2.92
  Bottom 0.61: v17.65,12.98 v17.65,7.87 17.65,5.08 19.81,2.92 JP2.1
VLIPO  (via drill 0.39)
  Top 0.254: U2.P$14 U2.P$15 21.78,7.94 v21.84,8 21.9,8.06 U2.P$16
  Top 0.406: 20.81,16.11 v20.95,16.26 20.95,14.8 C7.1
  Bottom 0.406: v21.84,8 21.59,8 | JP2.2 23.49,3.05 21.59,4.95 21.59,8 | v20.95,16.26 21.59,15.62 21.59,11.43 21.59,8
  Bottom 0.61: 21.59,11.43 20.85,12.17 19.82,12.17 19.29,12.71 19.29,16.8 17.57,18.51 9.71,18.51 7.99,20.23 7.99,27.52 10.16,29.69 10.16,39.62 BAT.P$1 | BAT.P$1 6.35,40.89 BAT.P$3 3.81,43.69 3.56,43.94 5.59,45.97 BAT.P$2 BAT.P$1

### Text on the board
tPlace: - / minus | + / plus | + | - | lbo=bcm26 | led=bcm27 | LOW | - | + | input | PowerHolder v1.01 | (c)2019 jdimpson / From an AdaFruit design | output | thermal | but=bcm17 | chrg | USB | Bat | Vs | EN | GND | G | 5V | PWR
bPlace: + | - | TPS61090 DC Boost | 5Vout: ~5.2V @ 1A+ output | 3.2V Low Batt Indicator | LiPoly: 3.7V/4.2V Li only! | Vsh: larger of USB/LiPo | USB | LIPO | Vsh | EN | GND | LBO | GND | 5Vo